# Altium project VXR7200_Bridge.PrjPcb (part 2 of 2)

## Sheet Supplies_LTM4643.SchDoc
size 431 x 279 mm; Organization: ORGANIZATION; Address1: ADDRESS 1; Address2: ADDRESS 2; Address3: ADDRESS 3; Address4: ADDRESS 4; Revision: -; SheetNumber: 6; SheetTotal: 8; ENG_APP_DATE: --/--/--; DSN_APP_DATE: --/--/--; CHK_APP_DATE: --/--/--
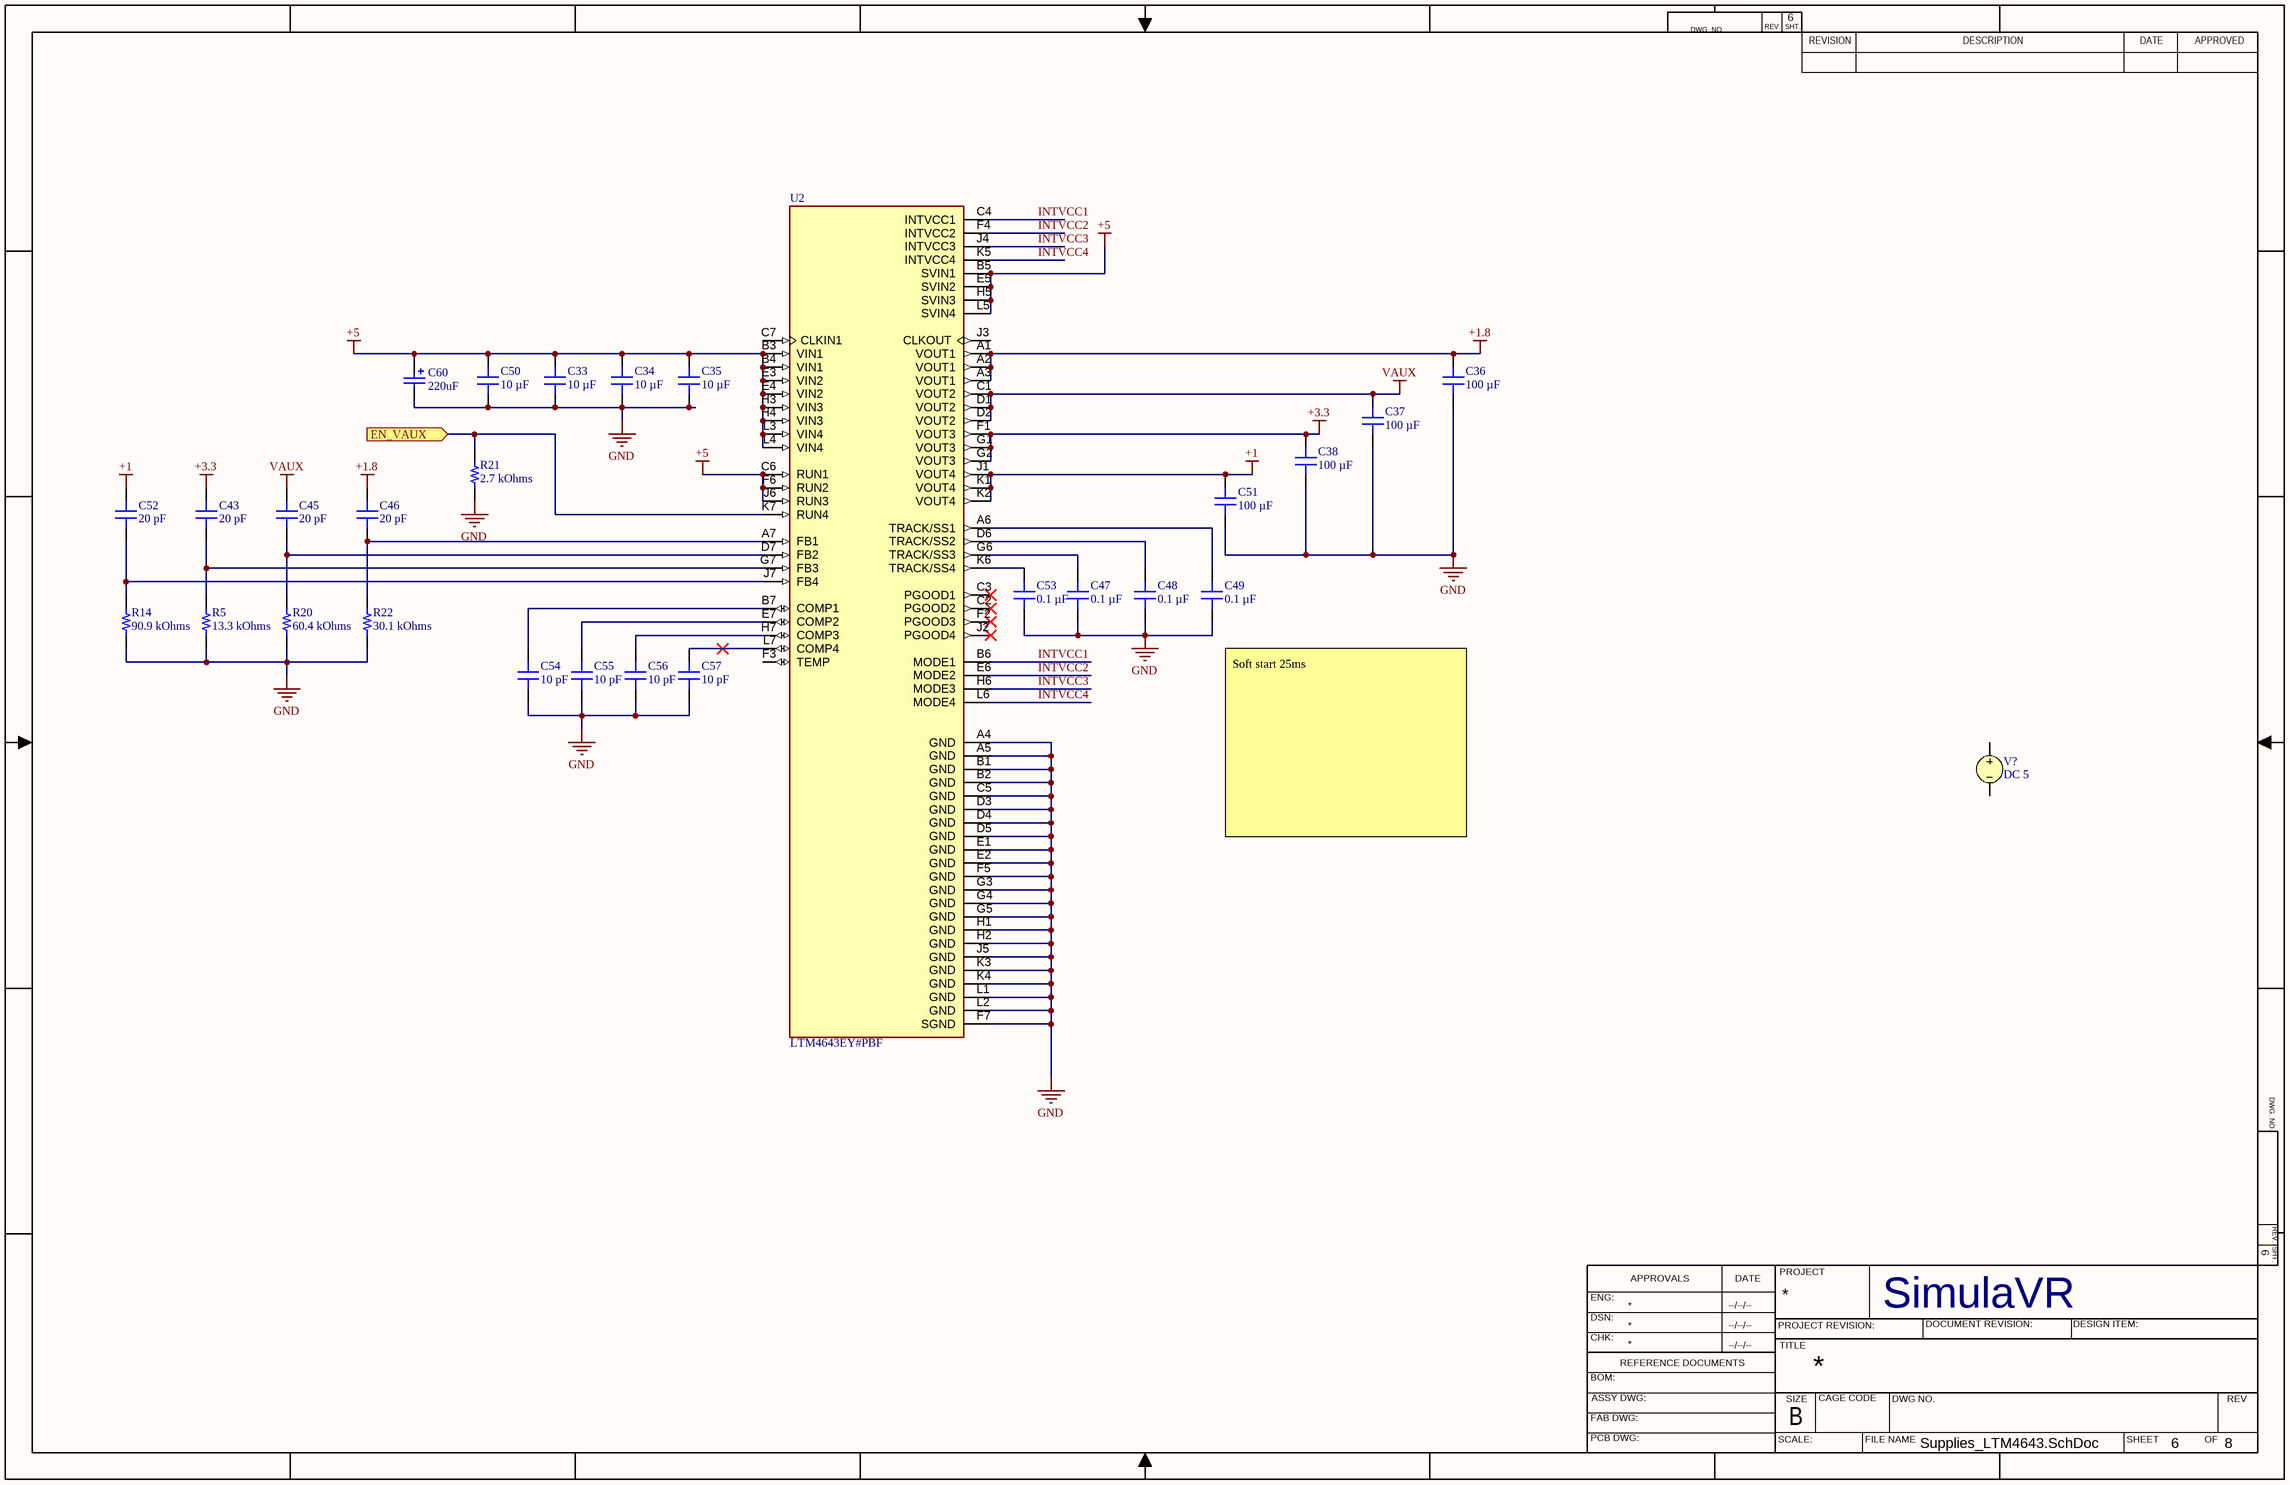
[diagram p5: Supplies_LTM4643.SchDoc]

### Parts
C33  10 µF  [CAP 0603_1608]
C34  10 µF  [CAP 0603_1608]
C35  10 µF  [CAP 0603_1608]
C36  100 µF  [CAP 0805_2012]
C37  100 µF  [CAP 0805_2012]
C38  100 µF  [CAP 0805_2012]
C43  20 pF  [CAP 0201_0603]
C45  20 pF  [CAP 0201_0603]
C46  20 pF  [CAP 0201_0603]
C47  0.1 µF  [CAP 0201_0603]
C48  0.1 µF  [CAP 0201_0603]
C49  0.1 µF  [CAP 0201_0603]
C50  10 µF  [CAP 0603_1608]
C51  100 µF  [CAP 0805_2012]
C52  20 pF  [CAP 0201_0603]
C53  0.1 µF  [CAP 0201_0603]
C54  10 pF  [CAP 0201_0603]
C55  10 pF  [CAP 0201_0603]
C56  10 pF  [CAP 0201_0603]
C57  10 pF  [CAP 0201_0603]
C60  220uF  [WCAP-PHGP_L7.3W4.3H1.9]
R5  13.3 kOhms  [RES 0201_0603]
R14  90.9 kOhms  [RES 0201_0603]
R20  60.4 kOhms  [RES 0201_0603]
R21  2.7 kOhms  [RES 0201_0603]
R22  30.1 kOhms  [RES 0201_0603]
U2  LTM4643EY#PBF  [BGA77C127P7X11_1500X900X262]
V?  DC 5

### Ports
EN_VAUX (in)

### Nets
+1: C51.2 C52.2 U2.J1(VOUT4) U2.K1(VOUT4) U2.K2(VOUT4)
+1.8: C36.2 C46.2 U2.A1(VOUT1) U2.A2(VOUT1) U2.A3(VOUT1)
+3.3: C38.2 C43.2 U2.F1(VOUT3) U2.G1(VOUT3) U2.G2(VOUT3)
+5: C33.2 C34.2 C35.2 C50.2 C60.1(P) U2.B3(VIN1) U2.B4(VIN1) U2.B5(SVIN1) U2.C6(RUN1) U2.E3(VIN2) U2.E4(VIN2) U2.E5(SVIN2) U2.F6(RUN2) U2.H3(VIN3) U2.H4(VIN3) U2.H5(SVIN3) U2.J6(RUN3) U2.L3(VIN4) U2.L4(VIN4) U2.L5(SVIN4)
GND: C33.1 C34.1 C35.1 C36.1 C37.1 C38.1 C47.1 C48.1 C49.1 C50.1 C51.1 C53.1 C54.1 C55.1 C56.1 C57.1 C60.2(N) R5.1 R14.1 R20.1 R21.2 R22.1 U2.A4(GND) U2.A5(GND) U2.B1(GND) U2.B2(GND) U2.C5(GND) U2.D3(GND) U2.D4(GND) U2.D5(GND) U2.E1(GND) U2.E2(GND) U2.F5(GND) U2.F7(SGND) U2.G3(GND) U2.G4(GND) U2.G5(GND) U2.H1(GND) U2.H2(GND) U2.J5(GND) U2.K3(GND) U2.K4(GND) U2.L1(GND) U2.L2(GND)
VAUX: C37.2 C45.2 U2.C1(VOUT2) U2.D1(VOUT2) U2.D2(VOUT2)
EN_VAUX: R21.1 U2.K7(RUN4) ; port EN_VAUX
INTVCC1: U2.B6(MODE1) U2.C4(INTVCC1)
INTVCC2: U2.E6(MODE2) U2.F4(INTVCC2)
INTVCC3: U2.H6(MODE3) U2.J4(INTVCC3)
INTVCC4: U2.K5(INTVCC4) U2.L6(MODE4)
NetC43_1: C43.1 R5.2 U2.G7(FB3)
NetC45_1: C45.1 R20.2 U2.D7(FB2)
NetC46_1: C46.1 R22.2 U2.A7(FB1)
NetC47_2: C47.2 U2.G6(TRACK/SS3)
NetC48_2: C48.2 U2.D6(TRACK/SS2)
NetC49_2: C49.2 U2.A6(TRACK/SS1)
NetC52_1: C52.1 R14.2 U2.J7(FB4)
NetC53_2: C53.2 U2.K6(TRACK/SS4)
NetC54_2: C54.2 U2.B7(COMP1)
NetC55_2: C55.2 U2.E7(COMP2)
NetC56_2: C56.2 U2.H7(COMP3)
NetC57_2: C57.2 U2.L7(COMP4)

Not connected (* = marked no-connect by the designer): U2 C2(PGOOD2)* C3(PGOOD1)* C7(CLKIN1) F2(PGOOD3)* F3(TEMP) J2(PGOOD4)* J3(CLKOUT); V? 1 2

### Notes on the sheet
- (near C49) Soft start 25ms
- DWG. NO.
- REV.
- SHT.
- REVISION
- DESCRIPTION
- DATE
- APPROVED
- ENG:
- APPROVALS
- PROJECT
- DSN:
- CHK:
- REFERENCE DOCUMENTS
- PROJECT REVISION:
- TITLE
- SimulaVR
- DOCUMENT REVISION:
- DESIGN ITEM:
- BOM:
- FAB DWG:
- PCB DWG:
- ASSY DWG:
- SCALE:
- SIZE
- B
- CAGE CODE
- FILE NAME
- DWG NO.
- SHEET
- OF
- REV

### Library data of the parts
C33-C35 C50 = GRM188R61C106MA73D: CAP CER 10UF 16V X5R 0603; manufacturer: Murata Electronics; Tolerance: ±20%; Part Number: GRM188R61C106MA73D; Value: 10 µF; Applications: General Purpose; Capacitance: 10 µF; componentlink1description: Datasheet; componentlink1url: https://www.murata.com/~/media/webrenewal/support/library/catalog/products/capacitor/mlcc/c02e.ashx?la=en-us; componentlink2description: DigiKey Link; componentlink2url: https://www.digikey.com/en/products/detail/murata-electronics/GRM188R61C106MA73D/3900480; Device Package: 0603 (1608 Metric); lastupdated: 2022-04-12 22:07:55; Lifecycle Status: Active; Minimum Order: 1; Mounting Type: Surface Mount, MLCC; Operating Temperature: -55°C ~ 85°C; Package / Case: 0603 (1608 Metric); packaging: TapeAndReel; partid: 15141; Part Status: Active; price: 0.04; series: GRM; Size / Dimension: 0.063" L x 0.031" W (1.60mm x 0.80mm); Supplier 1: DigiKey; Supplier Part Number 1: 490-7201-1-ND; Temperature Coefficient: X5R; Thickness (Max): 0.039" (1.00mm); Voltage - Rated: 16V
C36-C38 C51 = GRM21BR60J107ME15K: CAP CER 100UF 6.3V X5R 0805; manufacturer: Murata Electronics; Tolerance: ±20%; Part Number: GRM21BR60J107ME15K; Value: 100 µF; Applications: General Purpose; Capacitance: 100 µF; componentlink1description: Datasheet; componentlink1url: https://search.murata.co.jp/Ceramy/image/img/A01X/G101/ENG/GRM21BR60J107ME15-01A.pdf; componentlink2description: DigiKey Link; componentlink2url: https://www.digikey.com/en/products/detail/murata-electronics/GRM21BR60J107ME15K/9887675; Device Package: 0805 (2012 Metric); lastupdated: 2022-04-12 22:10:32; Lifecycle Status: Active; Minimum Order: 1; Mounting Type: Surface Mount, MLCC; Operating Temperature: -55°C ~ 85°C; Package / Case: 0805 (2012 Metric); packaging: TapeAndReel; partid: 39832; Part Status: Active; price: 0.42; series: GRM; Size / Dimension: 0.079" L x 0.049" W (2.00mm x 1.25mm); Supplier 1: DigiKey; Supplier Part Number 1: 490-GRM21BR60J107ME15KCT-ND; Temperature Coefficient: X5R; Thickness (Max): 0.057" (1.45mm); Voltage - Rated: 6.3V
C43 C45 C46 C52 = CC0201JRNPO8BN200: CAP CER 20PF 25V C0G/NPO 0201; manufacturer: Yageo; Temperature Coefficient: C0G, NP0; Tolerance: ±5%; Part Number: CC0201JRNPO8BN200; Value: 20 pF; Applications: General Purpose; Capacitance: 20 pF; componentlink1description: Datasheet; componentlink1url: https://www.yageo.com/upload/media/product/productsearch/datasheet/mlcc/UPY-GP_NP0_16V-to-50V_17.pdf; componentlink2description: DigiKey Link; componentlink2url: https://www.digikey.com/en/products/detail/yageo/CC0201JRNPO8BN200/5883132; Device Package: 0201 (0603 Metric); lastupdated: 2022-04-12 22:02:06; Lifecycle Status: Active; Minimum Order: 1; Mounting Type: Surface Mount, MLCC; Operating Temperature: -55°C ~ 125°C; Package / Case: 0201 (0603 Metric); packaging: CutTape; partid: 353; Part Status: Active; price: 0.01; series: CC; Size / Dimension: 0.024" L x 0.012" W (0.60mm x 0.30mm); Supplier 1: DigiKey; Supplier Part Number 1: 311-3315-1-ND; Thickness (Max): 0.013" (0.33mm); Voltage - Rated: 25V
C47-C49 C53 = GRM033R61E104KE14D: CAP CER 0.1UF 25V X5R 0201; manufacturer: Murata Electronics; Tolerance: ±10%; Part Number: GRM033R61E104KE14D; Value: 0.1 µF; Applications: General Purpose; Capacitance: 0.1 µF; componentlink1description: Datasheet; componentlink1url: https://search.murata.co.jp/Ceramy/image/img/A01X/G101/ENG/GRM033R61E104KE14-01.pdf; componentlink2description: DigiKey Link; componentlink2url: https://www.digikey.com/en/products/detail/murata-electronics/GRM033R61E104KE14D/4904731; Device Package: 0201 (0603 Metric); lastupdated: 5/20/2022 2:33:00 PM; Lifecycle Status: Active; Minimum Order: 1; Mounting Type: Surface Mount; Operating Temperature: -55°C ~ 85°C; Package / Case: 0201 (0603 Metric); packaging: TapeAndReel; partid: 39731; Part Status: Active; price: 0.01; series: GRM; Size / Dimension: 0.024" L x 0.012" W (0.60mm x 0.30mm); Supplier 1: DigiKey; Supplier Part Number 1: 490-12686-1-ND; Temperature Coefficient: X5R; Thickness (Max): 0.013" (0.33mm); Voltage - Rated: 25V
C54-C57 = GRM0335C1E100JA01D: CAP CER 10PF 25V C0G/NP0 0201; manufacturer: Murata Electronics; Temperature Coefficient: C0G, NP0; Tolerance: ±5%; Part Number: GRM0335C1E100JA01D; Value: 10 pF; Applications: General Purpose; Capacitance: 10 pF; componentlink1description: Datasheet; componentlink1url: https://search.murata.co.jp/Ceramy/image/img/A01X/G101/ENG/GRM0335C1E100JA01-01.pdf; componentlink2description: DigiKey Link; componentlink2url: https://www.digikey.com/en/products/detail/murata-electronics/GRM0335C1E100JA01D/4358173; Device Package: 0201 (0603 Metric); lastupdated: 2022-04-12 22:02:08; Lifecycle Status: Active; Minimum Order: 1; Mounting Type: Surface Mount, MLCC; Operating Temperature: -55°C ~ 125°C; Package / Case: 0201 (0603 Metric); packaging: CutTape; partid: 180; Part Status: Active; price: 0.01; series: GRM; Size / Dimension: 0.024" L x 0.012" W (0.60mm x 0.30mm); Supplier 1: DigiKey; Supplier Part Number 1: 490-8607-1-ND; Thickness (Max): 0.013" (0.33mm); Voltage - Rated: 25V
C60 = 875015119006: WCAP-PHGP Aluminum Polymer Capacitor, H-Chip SMT, L7.3W4.3H1.9mm, 220uF, 6.3V; Manufacturer: Wurth Elektronik; Capacitance Tolerance: +/-20%; Dissipation Factor: 6%; Endurance: 2000h; ESR: 15mOhm; Leakage Current: 138.6uA; Ripple Current: 5100mA; Technical Reference: PSE2917221M6R3DHCT2HT19; ComponentLink1Description: Manufacturer Link; ComponentLink1URL: https://www.we-online.com/redexpert/article/875015119006?ad; ComponentLink2Description: Datasheet; ComponentLink2URL: https://www.we-online.com/redexpert/spec/875015119006?ad; Category: Aluminum Polymer Capacitors; Match Code: WCAP-PHGP; Manufacturer Part Number: 875015119006; Mount: Surface Mount; Operating Temperature Max: 105°C; Operating Temperature Min: -55°C; Packaging: Tape and Reel; Length: 7.3mm; Width: 4.3mm; Height: 1.9mm; Capacitance: 220uF; Rated Voltage (DC): 6.3V
R5 = ERJ-1GNF1332C: RES SMD 13.3K OHM 1% 1/20W 0201; Manufacturer: Panasonic Electronic Components; Power (Watts): 0.05W, 1/20W; Temperature Coefficient: ±200ppm/°C; Part Number: ERJ-1GNF1332C; Value: 13.3 kOhms; ComponentLink1Description: Datasheet; ComponentLink1URL: https://industrial.panasonic.com/cdbs/www-data/pdf/RDA0000/AOA0000C304.pdf; ComponentLink2Description: DigiKey Link; ComponentLink2URL: https://www.digikey.com/en/products/detail/panasonic-electronic-components/ERJ-1GNF1332C/2036239; Composition: Thick Film; Device Package: 0201 (0603 Metric); Features: Automotive AEC-Q200; Height - Seated (Max): 0.010" (0.26mm); LastUpdated: 2022-04-12 22:15:43; Lifecycle Status: Active; Minimum Order: 1; Number of Terminations: 2; Operating Temperature: -55°C ~ 125°C; Package / Case: 0201 (0603 Metric); Packaging: TapeAndReel; PartId: 2366; Part Status: Active; Price: 0.01; Ratings: AEC-Q200; Resistance: 13.3 kOhms; Series: ERJ-1GN; Size / Dimension: 0.024" L x 0.012" W (0.60mm x 0.30mm); Supplier 1: DigiKey; Supplier Part Number 1: P122718CT-ND; Supplier Device Package: 0201; Tolerance: ±1%
R14 = ERJ-1GNF9092C: RES SMD 90.9K OHM 1% 1/20W 0201; Manufacturer: Panasonic Electronic Components; Power (Watts): 0.05W, 1/20W; Temperature Coefficient: ±200ppm/°C; Part Number: ERJ-1GNF9092C; Value: 90.9 kOhms; ComponentLink1Description: Datasheet; ComponentLink1URL: https://industrial.panasonic.com/cdbs/www-data/pdf/RDA0000/AOA0000C304.pdf; ComponentLink2Description: DigiKey Link; ComponentLink2URL: https://www.digikey.com/en/products/detail/panasonic-electronic-components/ERJ-1GNF9092C/2036335; Composition: Thick Film; Device Package: 0201 (0603 Metric); Features: Automotive AEC-Q200; Height - Seated (Max): 0.010" (0.26mm); LastUpdated: 2022-04-12 22:15:43; Lifecycle Status: Active; Minimum Order: 1; Number of Terminations: 2; Operating Temperature: -55°C ~ 125°C; Package / Case: 0201 (0603 Metric); Packaging: TapeAndReel; PartId: 2331; Part Status: Active; Price: 0.01; Ratings: AEC-Q200; Resistance: 90.9 kOhms; Series: ERJ-1GN; Size / Dimension: 0.024" L x 0.012" W (0.60mm x 0.30mm); Supplier 1: DigiKey; Supplier Part Number 1: P123196CT-ND; Supplier Device Package: 0201; Tolerance: ±1%
R20 = ERJ-1GNF6042C: RES SMD 60.4K OHM 1% 1/20W 0201; Manufacturer: Panasonic Electronic Components; Power (Watts): 0.05W, 1/20W; Temperature Coefficient: ±200ppm/°C; Part Number: ERJ-1GNF6042C; Value: 60.4 kOhms; ComponentLink1Description: Datasheet; ComponentLink1URL: https://industrial.panasonic.com/cdbs/www-data/pdf/RDA0000/AOA0000C304.pdf; ComponentLink2Description: DigiKey Link; ComponentLink2URL: https://www.digikey.com/en/products/detail/panasonic-electronic-components/ERJ-1GNF6042C/2036315; Composition: Thick Film; Device Package: 0201 (0603 Metric); Features: Automotive AEC-Q200; Height - Seated (Max): 0.010" (0.26mm); LastUpdated: 2022-04-12 22:15:43; Lifecycle Status: Active; Minimum Order: 1; Number of Terminations: 2; Operating Temperature: -55°C ~ 125°C; Package / Case: 0201 (0603 Metric); Packaging: TapeAndReel; PartId: 2409; Part Status: Active; Price: 0.01; Ratings: AEC-Q200; Resistance: 60.4 kOhms; Series: ERJ-1GN; Size / Dimension: 0.024" L x 0.012" W (0.60mm x 0.30mm); Supplier 1: DigiKey; Supplier Part Number 1: P123096CT-ND; Supplier Device Package: 0201; Tolerance: ±1%
R21 = ERJ-U01J272C: RES 2.7K OHM 5% 1/20W 0201 SMD; Manufacturer: Panasonic Electronic Components; Power (Watts): 0.05W, 1/20W; Temperature Coefficient: ±200ppm/°C; Part Number: ERJ-U01J272C; Value: 2.7 kOhms; ComponentLink1Description: Datasheet; ComponentLink1URL: https://industrial.panasonic.com/cdbs/www-data/pdf/RDP0000/AOA0000C334.pdf; ComponentLink2Description: DigiKey Link; ComponentLink2URL: https://www.digikey.com/en/products/detail/panasonic-electronic-components/ERJ-U01J272C/11641374; Composition: Thick Film; Device Package: 0201 (0603 Metric); Features: Anti-Sulfur; Height - Seated (Max): 0.010" (0.26mm); LastUpdated: 2022-04-12 22:15:26; Lifecycle Status: Active; Minimum Order: 1; Number of Terminations: 2; Operating Temperature: -55°C ~ 125°C; Package / Case: 0201 (0603 Metric); Packaging: TapeAndReel; PartId: 64645; Part Status: Active; Price: 0.04; Resistance: 2.7 kOhms; Series: ERJ-U01; Size / Dimension: 0.024" L x 0.012" W (0.60mm x 0.30mm); Supplier 1: DigiKey; Supplier Part Number 1: 10-ERJ-U01J272CCT-ND; Supplier Device Package: 0201; Tolerance: ±5%
R22 = ERJ-1GNF3012C: RES SMD 30.1K OHM 1% 1/20W 0201; Manufacturer: Panasonic Electronic Components; Power (Watts): 0.05W, 1/20W; Temperature Coefficient: ±200ppm/°C; Part Number: ERJ-1GNF3012C; Value: 30.1 kOhms; ComponentLink1Description: Datasheet; ComponentLink1URL: https://industrial.panasonic.com/cdbs/www-data/pdf/RDA0000/AOA0000C304.pdf; ComponentLink2Description: DigiKey Link; ComponentLink2URL: https://www.digikey.com/en/products/detail/panasonic-electronic-components/ERJ-1GNF3012C/2036279; Composition: Thick Film; Device Package: 0201 (0603 Metric); Features: Automotive AEC-Q200; Height - Seated (Max): 0.010" (0.26mm); LastUpdated: 2022-04-12 22:16:01; Lifecycle Status: Active; Minimum Order: 1; Number of Terminations: 2; Operating Temperature: -55°C ~ 125°C; Package / Case: 0201 (0603 Metric); Packaging: TapeAndReel; PartId: 21; Part Status: Active; Price: 0.01; Ratings: AEC-Q200; Resistance: 30.1 kOhms; Series: ERJ-1GN; Size / Dimension: 0.024" L x 0.012" W (0.60mm x 0.30mm); Supplier 1: DigiKey; Supplier Part Number 1: P122917CT-ND; Supplier Device Package: 0201; Tolerance: ±1%
U2 = LTM4643EY#PBF: LTM4643 - Ultrathin Quad ﾎｼModule Regulator with Configurable 3A Output Array; MF: {'manufacturer': u'Linear Technology/Analog'}; Availability: Unavailable; Price: None; MP: LTM4643EY#PBF; Value: *; Package: None
V? = VSRC: Voltage Source; Note: PCB Footprint - Not required; AC Magnitude: 1; AC Phase: 0; Value: 5; Published: 8-Jun-2000; LatestRevisionDate: 17-Jul-2002; LatestRevisionNote: Re-released for DXP Platform.; PackageReference: Not Applicable; Publisher: Altium Limited

## Sheet Misc.SchDoc
size 431 x 279 mm; Organization: ORGANIZATION; Address1: ADDRESS 1; Address2: ADDRESS 2; Address3: ADDRESS 3; Address4: ADDRESS 4; Revision: -; SheetNumber: 7; SheetTotal: 7; ENG_APP_DATE: --/--/--; DSN_APP_DATE: --/--/--; CHK_APP_DATE: --/--/--
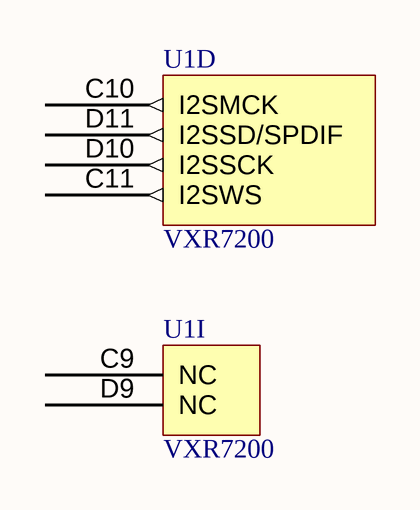
[diagram p6: Misc.SchDoc]

### Parts
U1  VXR7200  [BGA100P9X9-81A]  (parts D,I of 9)

### Nets

Not connected (* = marked no-connect by the designer): U1 C9(NC_) C10(I2SMCK_) C11(I2SWS_) D9(NC_) D10(I2SSCK_) D11(I2SSD/SPDIF_)

### Notes on the sheet
- DWG. NO.
- REV.
- SHT.
- REVISION
- DESCRIPTION
- DATE
- APPROVED
- ENG:
- APPROVALS
- PROJECT
- DSN:
- CHK:
- REFERENCE DOCUMENTS
- PROJECT REVISION:
- TITLE
- SimulaVR
- DOCUMENT REVISION:
- DESIGN ITEM:
- BOM:
- FAB DWG:
- PCB DWG:
- ASSY DWG:
- SCALE:
- SIZE
- B
- CAGE CODE
- FILE NAME
- DWG NO.
- SHEET
- OF
- REV

### Library data of the parts
U1 = CMP-015-00008-4: VXR7200 DP to MIPI-DSI bridge

## Sheet MCUConn.SchDoc
size 431 x 279 mm; Organization: ORGANIZATION; Address1: ADDRESS 1; Address2: ADDRESS 2; Address3: ADDRESS 3; Address4: ADDRESS 4; Revision: -; SheetNumber: 7; SheetTotal: 7; ENG_APP_DATE: --/--/--; DSN_APP_DATE: --/--/--; CHK_APP_DATE: --/--/--
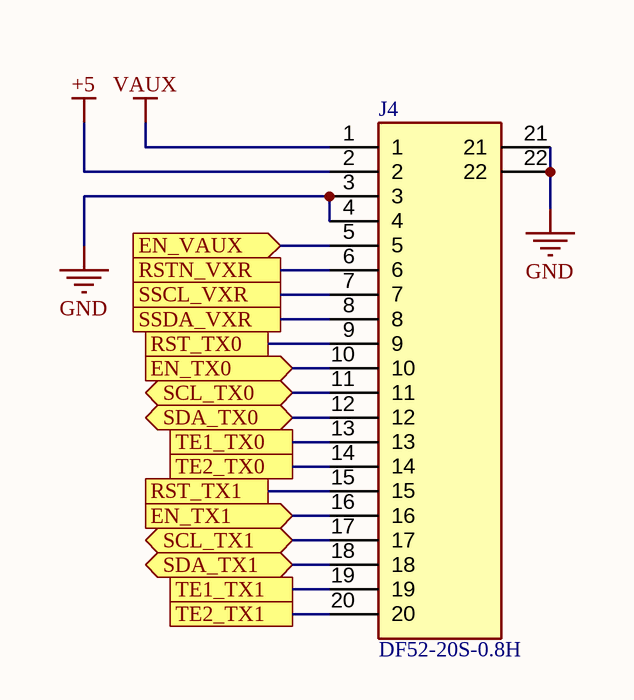
[diagram p7: MCUConn.SchDoc]

### Parts
J4  DF52-20S-0.8H  [DF5220S08H]

### Ports
EN_TX0 (in), EN_TX1 (in), EN_VAUX (in), RST_TX0, RST_TX1, RSTN_VXR, SCL_TX0 (bidir), SCL_TX1 (bidir), SDA_TX0 (bidir), SDA_TX1 (bidir), SSCL_VXR, SSDA_VXR, TE1_TX0, TE1_TX1, TE2_TX0, TE2_TX1

### Nets
+5: J4.2
GND: J4.3 J4.4 J4.21 J4.22
VAUX: J4.1
EN_TX0: J4.10 ; port EN_TX0
EN_TX1: J4.16 ; port EN_TX1
EN_VAUX: J4.5 ; port EN_VAUX
RST_TX0: J4.9 ; port RST_TX0
RST_TX1: J4.15 ; port RST_TX1
RSTN: J4.6 ; port RSTN_VXR
SCL_TX0: J4.11 ; port SCL_TX0
SCL_TX1: J4.17 ; port SCL_TX1
SDA_TX0: J4.12 ; port SDA_TX0
SDA_TX1: J4.18 ; port SDA_TX1
SSCL: J4.7 ; port SSCL_VXR
SSDA: J4.8 ; port SSDA_VXR
TE1_TX0: J4.13 ; port TE1_TX0
TE1_TX1: J4.19 ; port TE1_TX1
TE2_TX0: J4.14 ; port TE2_TX0
TE2_TX1: J4.20 ; port TE2_TX1

### Notes on the sheet
- DWG. NO.
- REV.
- SHT.
- REVISION
- DESCRIPTION
- DATE
- APPROVED
- ENG:
- APPROVALS
- PROJECT
- DSN:
- CHK:
- REFERENCE DOCUMENTS
- PROJECT REVISION:
- TITLE
- SimulaVR
- DOCUMENT REVISION:
- DESIGN ITEM:
- BOM:
- FAB DWG:
- PCB DWG:
- ASSY DWG:
- SCALE:
- SIZE
- B
- CAGE CODE
- FILE NAME
- DWG NO.
- SHEET
- OF
- REV

### Library data of the parts
J4 = DF52-20S-0.8H: Connector; Manufacturer_Name: Hirose; Datasheet Link: https://www.mouser.com/datasheet/2/185/DF52_catalog-939321.pdf; Height: 1mm; Manufacturer_Part_Number: DF52-20S-0.8H

## Nets that join several sheets
+1: PDN (FB1.1 FB2.1 FB3.1 FB4.1), Supplies_LTM4643 (5 pins)
+1.8: TX0 (C40.2 J2.2 R2.1 U4.14), TX1 (C42.2 J3.2 R3.1 U5.14), Supplies_LTM4643 (5 pins)
+3.3: RX_DP (R42.2), TX0 (C39.2 R25.2 U4.1), TX1 (C41.2 R26.2 U5.1), PDN (FB5.1 FB6.1), Control (15 pins), Supplies_LTM4643 (5 pins)
+5: RX_DP (J1.1 J1.2 J1.3), TX0 (J2.1), TX1 (J3.1), Supplies_LTM4643 (20 pins), MCUConn (J4.2)
GND: RX_DP (20 pins), TX0 (26 pins), TX1 (25 pins), PDN (47 pins), Control (11 pins), Supplies_LTM4643 (44 pins), MCUConn (J4.3 J4.4 J4.21 J4.22)
VAUX: Supplies_LTM4643 (5 pins), MCUConn (J4.1)
EN_TX0: TX0 (J2.5 R25.1), MCUConn (J4.10)
EN_TX1: TX1 (J3.5 R26.1), MCUConn (J4.16)
EN_VAUX: Supplies_LTM4643 (R21.1 U2.K7), MCUConn (J4.5)
RST_TX0: TX0 (U4.2), Control (R24.1), MCUConn (J4.9)
RST_TX1: TX1 (U5.2), Control (R23.1), MCUConn (J4.15)
RSTN: Control (R4.1 U1.C5), MCUConn (J4.6)
SCL_TX0: TX0 (J2.6), Control (U7.5), MCUConn (J4.11)
SCL_TX1: TX1 (J3.6), Control (U7.8), MCUConn (J4.17)
SDA_TX0: TX0 (J2.7), Control (U7.4), MCUConn (J4.12)
SDA_TX1: TX1 (J3.7), Control (U7.7), MCUConn (J4.18)
SSCL: Control (R16.1 U1.F11), MCUConn (J4.7)
SSDA: Control (R17.1 U1.E11), MCUConn (J4.8)
TE1_TX0: TX0 (U4.4), MCUConn (J4.13)
TE1_TX1: TX1 (U5.4), MCUConn (J4.19)
TE2_TX0: TX0 (U4.5), MCUConn (J4.14)
TE2_TX1: TX1 (U5.5), MCUConn (J4.20)